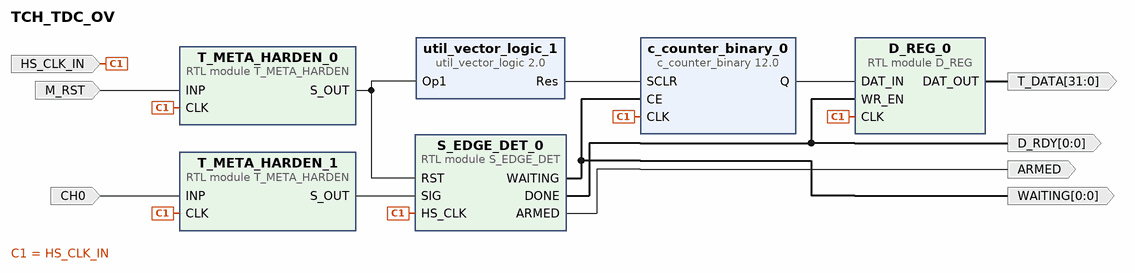
[diagram p0: block diagram of the top level]
# Vivado block design TCH_TDC_OV, xc7z020clg400-1, Vivado 2019.1
create_bd_design TCH_TDC_OV

create_bd_port -dir I HS_CLK_IN
create_bd_port -dir I CH0
create_bd_port -dir I M_RST
create_bd_port -dir O -from 0 -to 0 D_RDY
create_bd_port -dir O -from 31 -to 0 T_DATA
create_bd_port -dir O -from 0 -to 0 WAITING
create_bd_port -dir O ARMED

create_bd_cell -type ip -vlnv xilinx.com:ip:c_counter_binary:12.0 c_counter_binary_0
set_property -dict {CONFIG.CE true CONFIG.Output_Width 32 CONFIG.SCLR true} [get_bd_cells c_counter_binary_0]
create_bd_cell -type ip -vlnv xilinx.com:ip:util_vector_logic:2.0 util_vector_logic_1
set_property -dict {CONFIG.C_OPERATION not CONFIG.C_SIZE 1} [get_bd_cells util_vector_logic_1]
create_bd_cell -type module -reference D_REG D_REG_0
create_bd_cell -type module -reference T_META_HARDEN T_META_HARDEN_0
create_bd_cell -type module -reference T_META_HARDEN T_META_HARDEN_1
create_bd_cell -type module -reference S_EDGE_DET S_EDGE_DET_0

# ---- connections ----

connect_bd_net -net clk_wiz_0_clk_out1 [get_bd_ports HS_CLK_IN] \
  [get_bd_pins c_counter_binary_0/CLK] [get_bd_pins D_REG_0/CLK] [get_bd_pins T_META_HARDEN_0/CLK] \
  [get_bd_pins T_META_HARDEN_1/CLK] [get_bd_pins S_EDGE_DET_0/HS_CLK]
connect_bd_net [get_bd_pins util_vector_logic_1/Res] [get_bd_pins c_counter_binary_0/SCLR]
connect_bd_net -net util_vector_logic_3_Res [get_bd_pins S_EDGE_DET_0/WAITING] [get_bd_pins c_counter_binary_0/CE] [get_bd_ports WAITING]
connect_bd_net [get_bd_pins S_EDGE_DET_0/ARMED] [get_bd_ports ARMED]
connect_bd_net [get_bd_pins S_EDGE_DET_0/DONE] [get_bd_ports D_RDY] [get_bd_pins D_REG_0/WR_EN]
connect_bd_net [get_bd_pins c_counter_binary_0/Q] [get_bd_pins D_REG_0/DAT_IN]
connect_bd_net [get_bd_pins D_REG_0/DAT_OUT] [get_bd_ports T_DATA]
connect_bd_net -net META_HARDEN_0_S_OUT [get_bd_pins T_META_HARDEN_0/S_OUT] [get_bd_pins util_vector_logic_1/Op1] [get_bd_pins S_EDGE_DET_0/RST]
connect_bd_net [get_bd_ports M_RST] [get_bd_pins T_META_HARDEN_0/INP]
connect_bd_net -net CH0_1 [get_bd_ports CH0] [get_bd_pins T_META_HARDEN_1/INP]
connect_bd_net [get_bd_pins T_META_HARDEN_1/S_OUT] [get_bd_pins S_EDGE_DET_0/SIG]

validate_bd_design
save_bd_design
